# Altium project STM32F_Board.PrjPcb
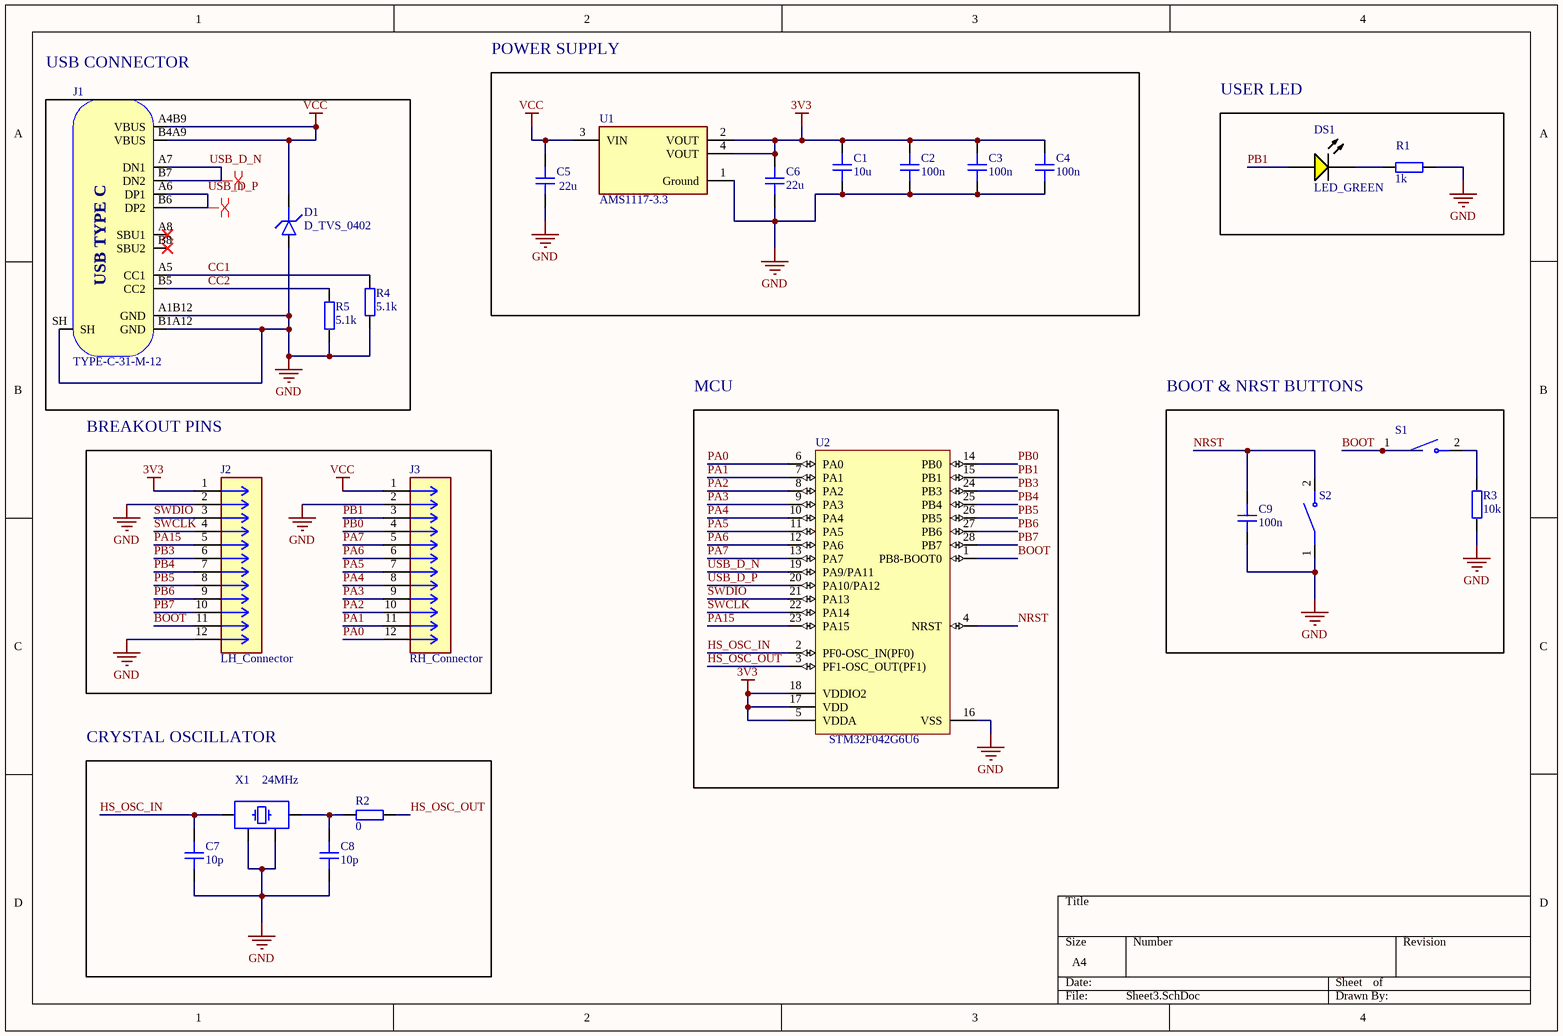
[diagram p0: Sheet3.SchDoc]
1 sheet, 24 parts. Net scope: global (net labels, ports and power ports of the same name join across sheets).
Board file: PCB1.PcbDoc

## Sheet Sheet3.SchDoc
size A4; SheetNumber: 1; SheetTotal: 1

### Parts
C1  10u  [CAP_0603]
C2  100n  [CAP_0402]
C3  100n  [CAP_0402]
C4  100n  [CAP_0402]
C5  22u  [CAP_0805]
C6  22u  [CAP_0805]
C7  10p  [CAP_0402]
C8  10p  [CAP_0402]
C9  100n  [CAP_0402]
D1  D_TVS_0402  [D_0402]
DS1  LED_GREEN  [EVRL-0603-2_V]
J1  TYPE-C-31-M-12  [TYPE-C-31-M-12]
J2  LH_Connector  [CONN_SD-42375-001_M320_12_MOL]
J3  RH_Connector  [CONN_SD-42375-001_M320_12_MOL]
R1  1k  [RES_0402]
R2  0  [RES_0402]
R3  10k  [RES_0402]
R4  5.1k  [RES_0402]
R5  5.1k  [RES_0402]
S1  (no value)  [SW_TS-1088-AR02016]
S2  (no value)  [SW_TS-1088-AR02016]
U1  AMS1117-3.3  [FP-AMS1117-IPC_C]
U2  STM32F042G6U6  [STM-UFQFPN28_V]
X1  24MHz  [XTAL_3225]

### Blocks framed on the sheet
POWER SUPPLY: C1-C6 U1
USER LED: DS1 R1
MCU: U2
BOOT & NRST BUTTONS: C9 R3 S1 S2
BREAKOUT PINS: J2 J3
CRYSTAL OSCILLATOR: C7 C8 R2 X1

### Nets
3V3: C1.2 C2.2 C3.2 C4.2 C6.2 J2.1 U1.2(VOUT) U1.4(VOUT) U2.5(VDDA) U2.17(VDD) U2.18(VDDIO2)
GND: C1.1 C2.1 C3.1 C4.1 C5.1 C6.1 C7.1 C8.1 C9.1 D1.A J1.A1B12(GND) J1.B1A12(GND) J1.SH J2.2 J2.12 J3.2 R1.2 R3.2 R4.2 R5.1 S2.1 U1.1(Ground) U2.16(VSS) X1.2 X1.4
VCC: C5.2 D1.K J1.A4B9(VBUS) J1.B4A9(VBUS) J3.1 U1.3(VIN)
BOOT: J2.11 S1.1 U2.1(PB8-BOOT0)
CC1: J1.A5(CC1) R4.1
CC2: J1.B5(CC2) R5.2
HS_OSC_IN: C7.2 U2.2(PF0-OSC_IN(PF0)) X1.1
HS_OSC_OUT: R2.1 U2.3(PF1-OSC_OUT(PF1))
NRST: C9.2 S2.2 U2.4(NRST)
PA0: J3.12 U2.6(PA0)
PA1: J3.11 U2.7(PA1)
PA2: J3.10 U2.8(PA2)
PA3: J3.9 U2.9(PA3)
PA4: J3.8 U2.10(PA4)
PA5: J3.7 U2.11(PA5)
PA6: J3.6 U2.12(PA6)
PA7: J3.5 U2.13(PA7)
PA15: J2.5 U2.23(PA15)
PB0: J3.4 U2.14(PB0)
PB1: DS1.1(A) J3.3 U2.15(PB1)
PB3: J2.6 U2.24(PB3)
PB4: J2.7 U2.25(PB4)
PB5: J2.8 U2.26(PB5)
PB6: J2.9 U2.27(PB6)
PB7: J2.10 U2.28(PB7)
SWCLK: J2.4 U2.22(PA14)
SWDIO: J2.3 U2.21(PA13)
USB_D_N: J1.A7(DN1) J1.B7(DN2) U2.19(PA9/PA11)
USB_D_P: J1.A6(DP1) J1.B6(DP2) U2.20(PA10/PA12)
NetC8_2: C8.2 R2.2 X1.3
NetDS1_2: DS1.2(K) R1.1
NetR3_1: R3.1 S1.2

Not connected (* = marked no-connect by the designer): J1 A8(SBU1)* B8(SBU2)*

### Layout directives
differential pair: USB_D_N, USB_D_P

### Notes on the sheet
- USB CONNECTOR
- (in symbol TYPE-C-31-M-12) USB TYPE C

### Library data of the parts
C1 = CAP_0603: Capacitor SMD 0603; Manufacturer: *; Manufacturer Part Number: *; Distributor Link: *; LCSC: *; Rating: *; Dielectric: *
C2-C4 C7-C9 = CAP_0402: Capacitor SMD 0402; Manufacturer: *; Manufacturer Part Number: *; Distributor Link: *; LCSC: *; Rating: *; Dielectric: *
C5 C6 = CAP_0805: Capacitor SMD 0805; Manufacturer: *; Manufacturer Part Number: *; Distributor Link: *; LCSC: *; Rating: *; Dielectric: *
D1 = D_TVS_0402: Diode TVS / ESD 0402
DS1 = CMP-007-00005-2: Chip LED, Yellow, 5 V, 25mA, -40 to 85 degC, 2-Pin SMD (0603), RoHS, Tape and Reel; Manufacturer: Everlight Electronics; Datasheet Version: Rev. 1.0, 12/2005; Package Reference: 0603; Mounting Technology: SM; Package Description: 2-Pin Surface Mount Device, Body 1.6 x 0.8 mm; Case/Package: 0603; Datasheet URL: http://www.fairchip.com/pdf/Everlight/19-217-Y5C-AM1N1VY-3T.pdf; Manufacturer URL: http://www.everlight.com/; RoHS Compliant: False
J1 = TYPE-C-31-M-12: USB Type C Connector Horizontal SMT; Manufacturer: Koren Hroparts; Manufacturer Part Number: TYPE-C-31-M-12
J2 J3 = CMP-011-000000-1: Availability: Unavailable; Package: None; MP: 22284121; Design Item ID: 22284121; Price: None; Value: *; Pin Count: 12; Source: 22284121.SchLib; Component Type: Standard
R1-R5 = RES_0402: Resistor SMD 0402; Manufacturer: *; Manufacturer Part Number: *; Distributor Link: *; LCSC: *
S1 S2 = CMP-005-000000-1: 50mA 4mm 100MÎ© 100,000 Times 12V 160gf 3mm 2mm Round Button Vertical welding SPST SMD Tactile Switches ROHS; MF: Xunpu; Check_prices: https://www.snapeda.com/parts/TS-1088-AR02016/Xunpu/view-part/?ref=eda; Pin Count: 2; Source: TS-1088-AR02016.SchLib; MP: TS-1088-AR02016; Value: *; SnapEDA_Link: https://www.snapeda.com/parts/TS-1088-AR02016/Xunpu/view-part/?ref=snap; Component Type: Standard; Design Item ID: TS-1088-AR02016; Package: Package; ComponentLink1Description: New link; ComponentLink1URL: https://jlcpcb.com/partdetail/XUNPU-TS_1088AR02016/C720477
U1 = CMP-209535-000001-1: LDO Voltage Regulators 1A, 3.3V; Manufacturer: Advanced Monolithic Systems; Dropout Voltage: 1.1V; Output Type: Fixed; Nominal Supply Current: 5mA; Max Power Dissipation: 1.2W; Max Supply Voltage: 15V; Number Of Outputs: 1; Standoff Height: 0.64mm; Max Junction Temp: +125°C; Height: 1.8mm; Package: AMS1117; Device Class L2: Power Management ICs; ComponentLink2Description: Datasheet; ComponentLink2URL: http://www.advanced-monolithic.com/pdf/ds1117.pdf; Category: IC; RoHS: TRUE; Automotive: No; Device Class L1: Integrated Circuits (ICs); Output Current: 1A; Device Class L3: Voltage Regulators - Linear; Temperature: -40°C to +125°C; Output Voltage: 3.3V; Manufacturer Part Number: AMS1117-3.3; Temperature Range Low: -40°C; Octopart: https://octopart.com/ams1117-3.3-advanced+monolithic+systems-25899300; Lead Free: Yes; Ipc Land Pattern Name: SOT229P700X180-4; Temperature Range High: +125°C
U2 = CMP-0304-00112-2: ARM Cortex-M0 32-bit MCU, 32 KB Flash, 6 KB Internal RAM, 24 I/Os, 28-Pin UFQFPN, -40 to 85 degC, Tray; Manufacturer: STMicroelectronics; FLASH Size (Prog) (kB): 32; I/Os (High Current): 24; Internal RAM Size (kB): 6; Supply Voltage(Vcc) min (V): 2; Operating Frequency(F) (Processor speed) (MHz): 48; Core: ARM Cortex-M0; PartNumber: STM32F042G6U6; Packing: Tray; Package Description: 28-Pin Ultra Thin Fine Pitch Quad Flat No-Lead, 4 x 4 x 0.6 mm Body, 0.5 mm Pitch; ComponentLink2Description: Datasheet; ComponentLink1Description: Manufacturer URL; Package Reference: UFQFPN28; DatasheetVersion: Rev. 5; ComponentLink1URL: http://www.st.com/; ComponentLink2URL: http://www.st.com/st-web-ui/static/active/en/resource/technical/document/datasheet/DM00105814.pdf; Mounting Technology: Surface Mount
X1 = TSX-3225_24.0000MF15X-AC: Crystal SMD 24MHz 10PPM 7pF 3225; Manufacturer: Epson; Manufacturer Part Number: TSX-3225 24.0000MF15X-AC; ComponentLink1Description: New link; ComponentLink1URL: https://jlcpcb.com/partdetail/YXC_CrystalOscillators-X322524MSB4SI/C15643